# Altium schematic sheet Pg13_FPGA_Connectors.SchDoc: FPGA CONNECTORS
size A2; DocumentNumber: 13; SheetNumber: 13; SheetTotal: 16
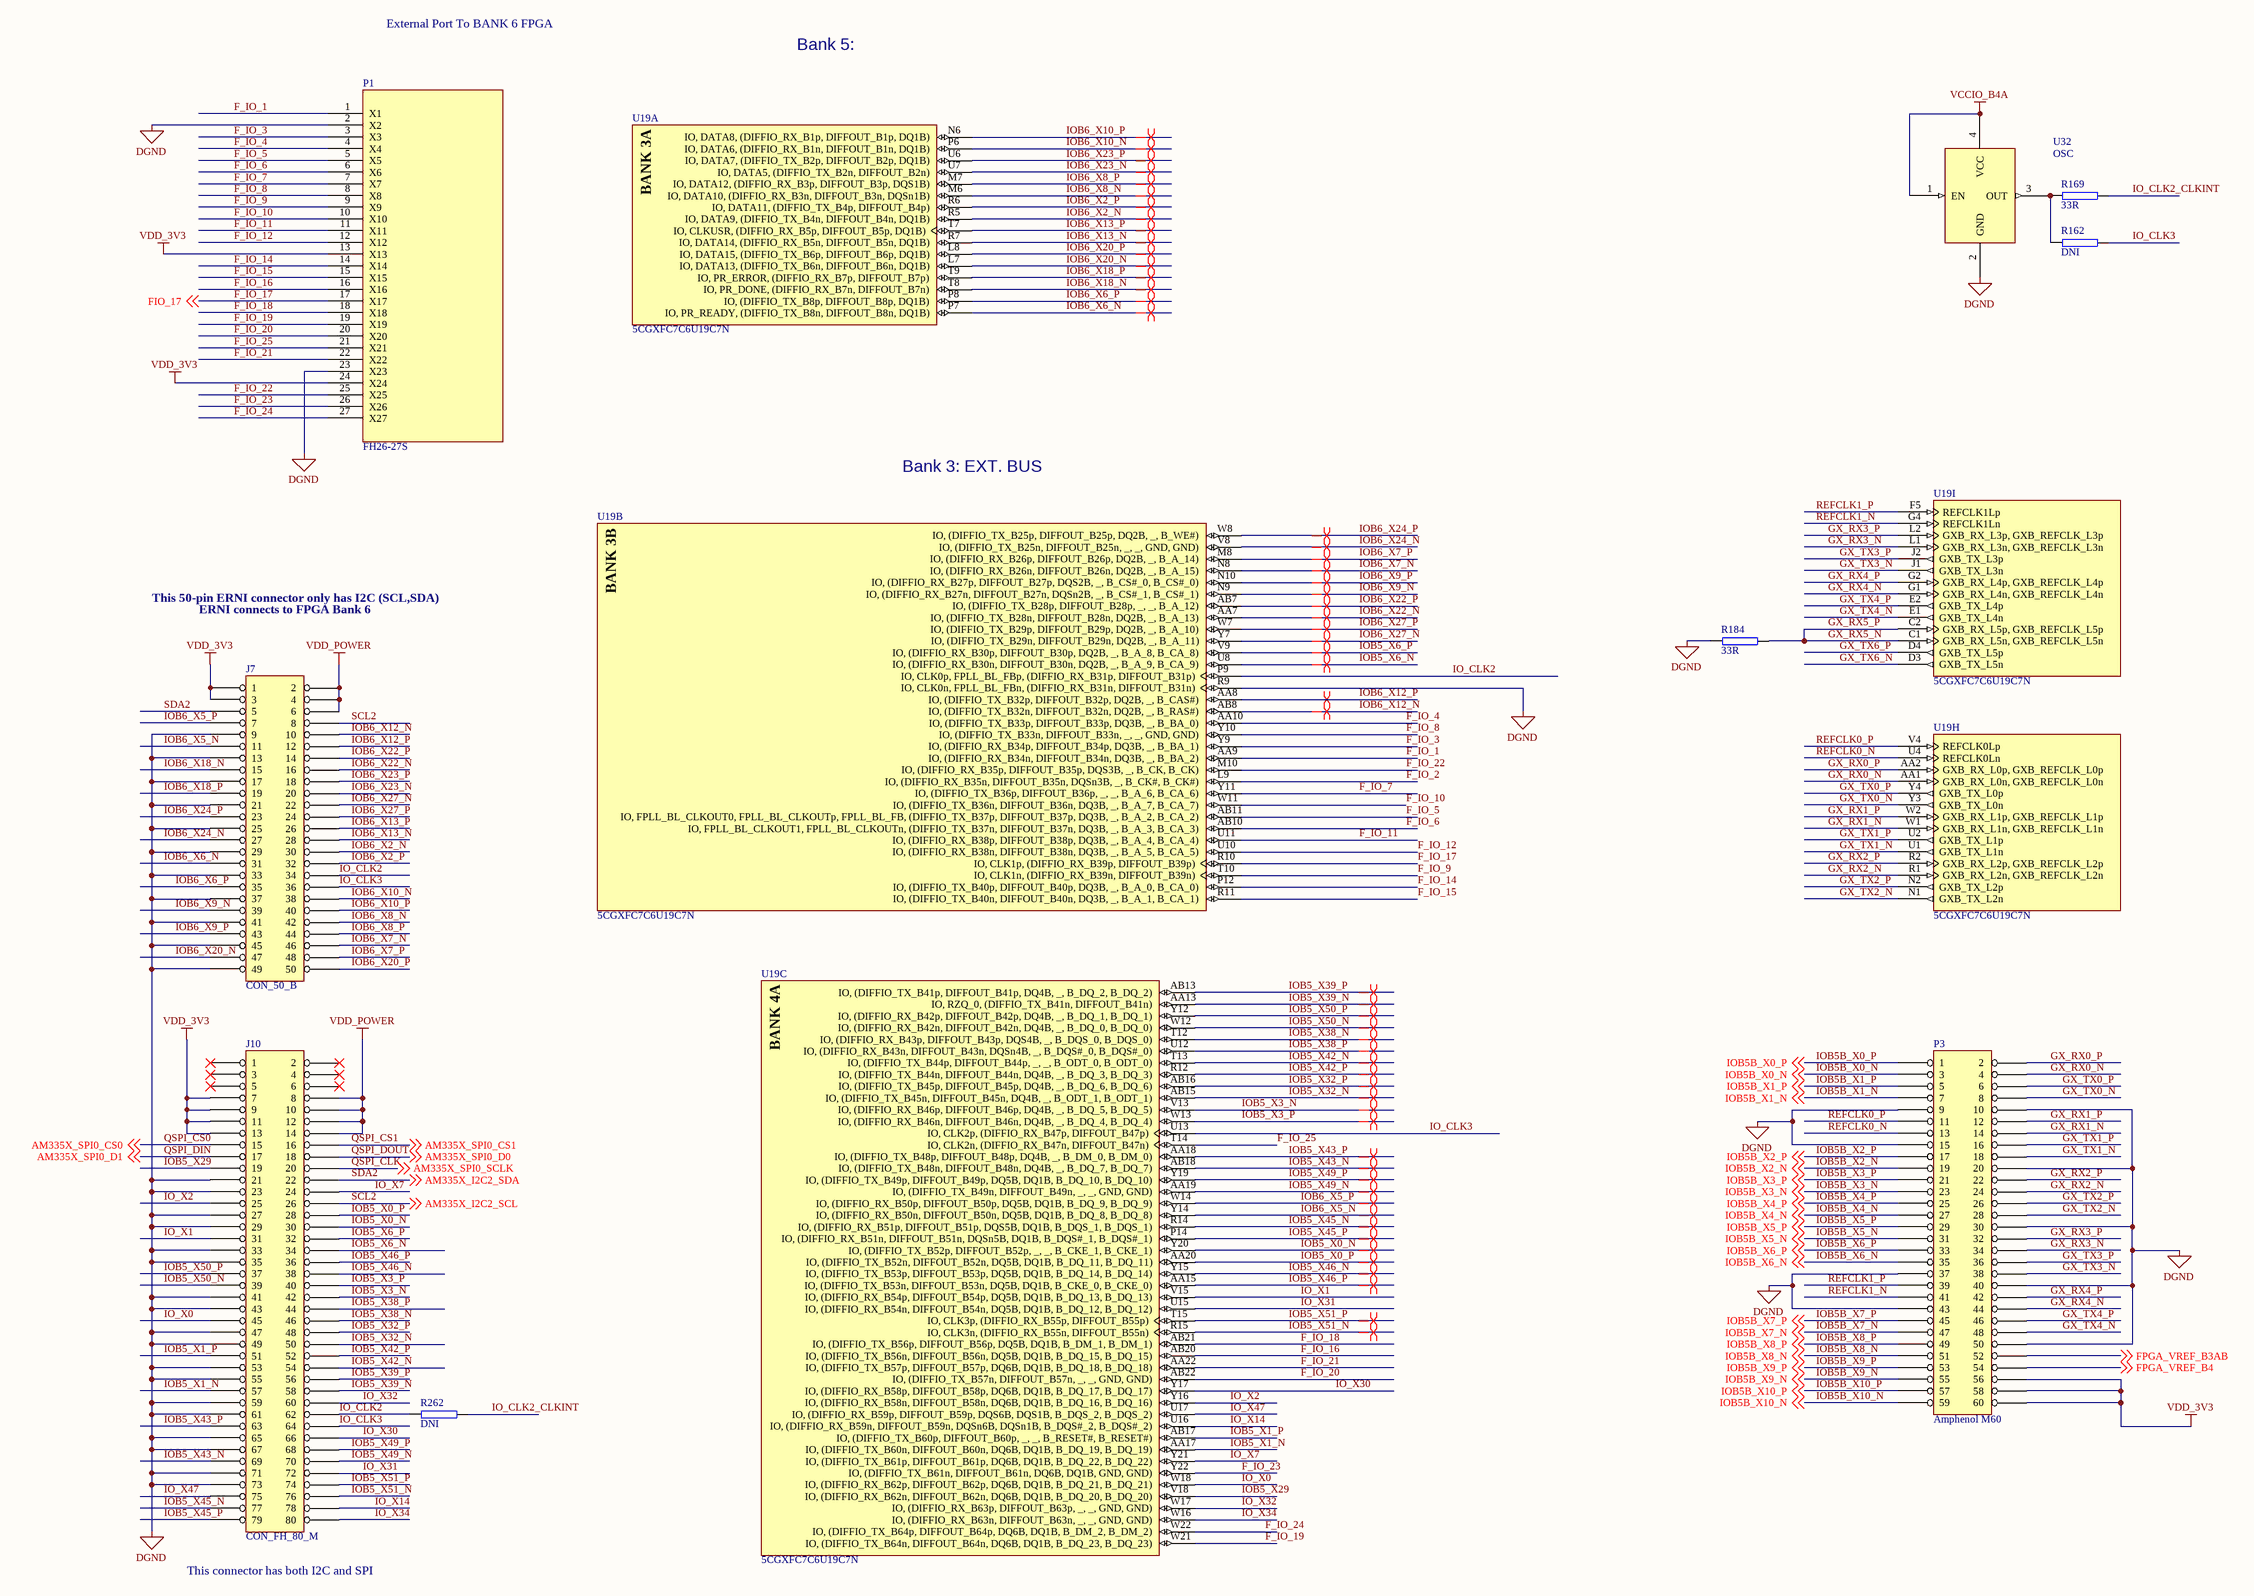
[diagram p0: Pg13_FPGA_Connectors.SchDoc]

## Parts
?  (no value)  (graphical)
J7  CON_50_B  [CON_50_B]
J10  CON_FH_80_M  [CON_FH_80_M]
P1  FH26-27S  [FH26-27S]
P3  Amphenol M60  [CON60_M]
R162  DNI  [sc0402]
R169  33R  [sc0402]
R184  33R  [sc0402]
R262  DNI  [sc0402]
U19  5CGXFC7C6U19C7N  [ALTR-UBGA484_A-190]  (parts A,B,C,H,I of 13)
U32  OSC  [Osc 3.2x2.5]

## Nets
DGND: J7.9 J7.13 J7.17 J7.21 J7.25 J7.29 J7.33 J7.37 J7.41 J7.45 J7.49 J10.21 J10.23 J10.27 J10.29 J10.33 J10.35 J10.41 J10.43 J10.47 J10.49 J10.53 J10.55 J10.59 J10.61 J10.65 J10.67 J10.71 J10.73 P1.2(X2) P1.23(X23) P3.9 P3.10 P3.15 P3.20 P3.30 P3.37 P3.40 P3.43 P3.50 R184.1 U19.R9(IO,_CLK0n,_FPLL_BL_FBn,_(DIFFIO_RX_B31n,_DIFFOUT_B31n)) U32.2(GND)
VCCIO_B4A: U32.1(EN) U32.4(VCC)
VDD_3V3: J7.1 J7.3 J10.7 J10.9 J10.11 J10.13 P1.13(X13) P1.24(X24) P3.56 P3.58 P3.60
VDD_POWER: J7.2 J7.4 J7.6 J10.8 J10.10 J10.12 J10.14
F_IO_1: P1.1(X1) U19.AA9(IO,_(DIFFIO_RX_B34n,_DIFFOUT_B34n,_DQ3B,__,_B_BA_2))
F_IO_2: U19.L9(IO,_(DIFFIO_RX_B35n,_DIFFOUT_B35n,_DQSn3B,__,_B_CK#,_B_CK#))
F_IO_3: P1.3(X3) U19.Y9(IO,_(DIFFIO_RX_B34p,_DIFFOUT_B34p,_DQ3B,__,_B_BA_1))
F_IO_4: P1.4(X4) U19.AA10(IO,_(DIFFIO_TX_B33p,_DIFFOUT_B33p,_DQ3B,__,_B_BA_0))
F_IO_5: P1.5(X5) U19.AB11(IO,_FPLL_BL_CLKOUT0,_FPLL_BL_CLKOUTp,_FPLL_BL_FB,_(DIFFIO_TX_B37p,_DIFFOUT_B37p,_DQ3B,__,_B_A_2,_B_CA_2))
F_IO_6: P1.6(X6) U19.AB10(IO,_FPLL_BL_CLKOUT1,_FPLL_BL_CLKOUTn,_(DIFFIO_TX_B37n,_DIFFOUT_B37n,_DQ3B,__,_B_A_3,_B_CA_3))
F_IO_7: P1.7(X7) U19.Y11(IO,_(DIFFIO_TX_B36p,_DIFFOUT_B36p,__,__,_B_A_6,_B_CA_6))
F_IO_8: P1.8(X8) U19.Y10(IO,_(DIFFIO_TX_B33n,_DIFFOUT_B33n,__,__,_GND,_GND))
F_IO_9: P1.9(X9) U19.T10(IO,_CLK1n,_(DIFFIO_RX_B39n,_DIFFOUT_B39n))
F_IO_10: P1.10(X10) U19.W11(IO,_(DIFFIO_TX_B36n,_DIFFOUT_B36n,_DQ3B,__,_B_A_7,_B_CA_7))
F_IO_11: P1.11(X11) U19.U11(IO,_(DIFFIO_RX_B38p,_DIFFOUT_B38p,_DQ3B,__,_B_A_4,_B_CA_4))
F_IO_12: P1.12(X12) U19.U10(IO,_(DIFFIO_RX_B38n,_DIFFOUT_B38n,_DQ3B,__,_B_A_5,_B_CA_5))
F_IO_14: P1.14(X14) U19.P12(IO,_(DIFFIO_TX_B40p,_DIFFOUT_B40p,_DQ3B,__,_B_A_0,_B_CA_0))
F_IO_15: P1.15(X15) U19.R11(IO,_(DIFFIO_TX_B40n,_DIFFOUT_B40n,_DQ3B,__,_B_A_1,_B_CA_1))
F_IO_16: P1.16(X16) U19.AB20(IO,_(DIFFIO_TX_B56n,_DIFFOUT_B56n,_DQ5B,_DQ1B,_B_DQ_15,_B_DQ_15))
F_IO_17: P1.17(X17) U19.R10(IO,_CLK1p,_(DIFFIO_RX_B39p,_DIFFOUT_B39p)) ; off-sheet FIO_17  [also labelled FIO_17]
F_IO_18: P1.18(X18) U19.AB21(IO,_(DIFFIO_TX_B56p,_DIFFOUT_B56p,_DQ5B,_DQ1B,_B_DM_1,_B_DM_1))
F_IO_19: P1.19(X19) U19.W21(IO,_(DIFFIO_TX_B64n,_DIFFOUT_B64n,_DQ6B,_DQ1B,_B_DQ_23,_B_DQ_23))
F_IO_20: P1.20(X20) U19.AB22(IO,_(DIFFIO_TX_B57n,_DIFFOUT_B57n,__,__,_GND,_GND))
F_IO_21: P1.22(X22) U19.AA22(IO,_(DIFFIO_TX_B57p,_DIFFOUT_B57p,_DQ6B,_DQ1B,_B_DQ_18,_B_DQ_18))
F_IO_22: P1.25(X25) U19.M10(IO,_(DIFFIO_RX_B35p,_DIFFOUT_B35p,_DQS3B,__,_B_CK,_B_CK))
F_IO_23: P1.26(X26) U19.Y22(IO,_(DIFFIO_TX_B61n,_DIFFOUT_B61n,_DQ6B,_DQ1B,_GND,_GND))
F_IO_24: P1.27(X27) U19.W22(IO,_(DIFFIO_TX_B64p,_DIFFOUT_B64p,_DQ6B,_DQ1B,_B_DM_2,_B_DM_2))
F_IO_25: P1.21(X21) U19.T14(IO,_CLK2n,_(DIFFIO_RX_B47n,_DIFFOUT_B47n))
FPGA_VREF_B3AB: P3.52 ; off-sheet FPGA_VREF_B3AB
FPGA_VREF_B4: P3.54 ; off-sheet FPGA_VREF_B4
GX_RX0_N: P3.4 U19.AA1(GXB_RX_L0n,_GXB_REFCLK_L0n)
GX_RX0_P: P3.2 U19.AA2(GXB_RX_L0p,_GXB_REFCLK_L0p)
GX_RX1_N: P3.14 U19.W1(GXB_RX_L1n,_GXB_REFCLK_L1n)
GX_RX1_P: P3.12 U19.W2(GXB_RX_L1p,_GXB_REFCLK_L1p)
GX_RX2_N: P3.24 U19.R1(GXB_RX_L2n,_GXB_REFCLK_L2n)
GX_RX2_P: P3.22 U19.R2(GXB_RX_L2p,_GXB_REFCLK_L2p)
GX_RX3_N: P3.34 U19.L1(GXB_RX_L3n,_GXB_REFCLK_L3n)
GX_RX3_P: P3.32 U19.L2(GXB_RX_L3p,_GXB_REFCLK_L3p)
GX_RX4_N: P3.44 U19.G1(GXB_RX_L4n,_GXB_REFCLK_L4n)
GX_RX4_P: P3.42 U19.G2(GXB_RX_L4p,_GXB_REFCLK_L4p)
GX_RX5_N: R184.2 U19.C1(GXB_RX_L5n,_GXB_REFCLK_L5n) U19.C2(GXB_RX_L5p,_GXB_REFCLK_L5p)  [also labelled GX_RX5_P]
GX_TX0_N: P3.8 U19.Y3(GXB_TX_L0n)
GX_TX0_P: P3.6 U19.Y4(GXB_TX_L0p)
GX_TX1_N: P3.18 U19.U1(GXB_TX_L1n)
GX_TX1_P: P3.16 U19.U2(GXB_TX_L1p)
GX_TX2_N: P3.28 U19.N1(GXB_TX_L2n)
GX_TX2_P: P3.26 U19.N2(GXB_TX_L2p)
GX_TX3_N: P3.38 U19.J1(GXB_TX_L3n)
GX_TX3_P: P3.36 U19.J2(GXB_TX_L3p)
GX_TX4_N: P3.48 U19.E1(GXB_TX_L4n)
GX_TX4_P: P3.46 U19.E2(GXB_TX_L4p)
GX_TX6_N: U19.D3(GXB_TX_L5n)
GX_TX6_P: U19.D4(GXB_TX_L5p)
IO_CLK2: J7.34 J10.62 R262.1 U19.P9(IO,_CLK0p,_FPLL_BL_FBp,_(DIFFIO_RX_B31p,_DIFFOUT_B31p))
IO_CLK2_CLKINT: R169.2 R262.2
IO_CLK3: J7.36 J10.64 R162.2 U19.U13(IO,_CLK2p,_(DIFFIO_RX_B47p,_DIFFOUT_B47p))
IO_X0: J10.45 U19.W18(IO,_(DIFFIO_RX_B62p,_DIFFOUT_B62p,_DQ6B,_DQ1B,_B_DQ_21,_B_DQ_21))
IO_X1: J10.31 U19.V15(IO,_(DIFFIO_RX_B54p,_DIFFOUT_B54p,_DQ5B,_DQ1B,_B_DQ_13,_B_DQ_13))
IO_X2: J10.25 U19.Y16(IO,_(DIFFIO_RX_B58n,_DIFFOUT_B58n,_DQ6B,_DQ1B,_B_DQ_16,_B_DQ_16))
IO_X7: J10.24 U19.Y21(IO,_(DIFFIO_TX_B61p,_DIFFOUT_B61p,_DQ6B,_DQ1B,_B_DQ_22,_B_DQ_22))
IO_X14: J10.78 U19.U16(IO,_(DIFFIO_RX_B59n,_DIFFOUT_B59n,_DQSn6B,_DQSn1B,_B_DQS#_2,_B_DQS#_2))
IO_X30: J10.66 U19.Y17(IO,_(DIFFIO_RX_B58p,_DIFFOUT_B58p,_DQ6B,_DQ1B,_B_DQ_17,_B_DQ_17))
IO_X31: J10.72 U19.U15(IO,_(DIFFIO_RX_B54n,_DIFFOUT_B54n,_DQ5B,_DQ1B,_B_DQ_12,_B_DQ_12))
IO_X32: J10.60 U19.W17(IO,_(DIFFIO_RX_B63p,_DIFFOUT_B63p,__,__,_GND,_GND))
IO_X34: J10.80 U19.W16(IO,_(DIFFIO_RX_B63n,_DIFFOUT_B63n,__,__,_GND,_GND))
IO_X47: J10.75 U19.U17(IO,_(DIFFIO_RX_B59p,_DIFFOUT_B59p,_DQS6B,_DQS1B,_B_DQS_2,_B_DQS_2))
IOB5_X0_N: J10.30 U19.Y20(IO,_(DIFFIO_TX_B52p,_DIFFOUT_B52p,__,__,_B_CKE_1,_B_CKE_1))
IOB5_X0_P: J10.28 U19.AA20(IO,_(DIFFIO_TX_B52n,_DIFFOUT_B52n,_DQ5B,_DQ1B,_B_DQ_11,_B_DQ_11))
IOB5_X1_N: J10.57 U19.AA17(IO,_(DIFFIO_TX_B60n,_DIFFOUT_B60n,_DQ6B,_DQ1B,_B_DQ_19,_B_DQ_19))
IOB5_X1_P: J10.51 U19.AB17(IO,_(DIFFIO_TX_B60p,_DIFFOUT_B60p,__,__,_B_RESET#,_B_RESET#))
IOB5_X3_N: J10.42 U19.V13(IO,_(DIFFIO_RX_B46p,_DIFFOUT_B46p,_DQ4B,__,_B_DQ_5,_B_DQ_5))
IOB5_X3_P: J10.40 U19.W13(IO,_(DIFFIO_RX_B46n,_DIFFOUT_B46n,_DQ4B,__,_B_DQ_4,_B_DQ_4))
IOB5_X6_N: J10.34 U19.U8(IO,_(DIFFIO_RX_B30n,_DIFFOUT_B30n,_DQ2B,__,_B_A_9,_B_CA_9))
IOB5_X6_P: J10.32 U19.V9(IO,_(DIFFIO_RX_B30p,_DIFFOUT_B30p,_DQ2B,__,_B_A_8,_B_CA_8))
IOB5_X29: J10.19 U19.V18(IO,_(DIFFIO_RX_B62n,_DIFFOUT_B62n,_DQ6B,_DQ1B,_B_DQ_20,_B_DQ_20))
IOB5_X32_N: J10.50 U19.AB15(IO,_(DIFFIO_TX_B45n,_DIFFOUT_B45n,_DQ4B,__,_B_ODT_1,_B_ODT_1))
IOB5_X32_P: J10.48 U19.AB16(IO,_(DIFFIO_TX_B45p,_DIFFOUT_B45p,_DQ4B,__,_B_DQ_6,_B_DQ_6))
IOB5_X38_N: J10.46 U19.T12(IO,_(DIFFIO_RX_B43p,_DIFFOUT_B43p,_DQS4B,__,_B_DQS_0,_B_DQS_0))
IOB5_X38_P: J10.44 U19.U12(IO,_(DIFFIO_RX_B43n,_DIFFOUT_B43n,_DQSn4B,__,_B_DQS#_0,_B_DQS#_0))
IOB5_X39_N: J10.58 U19.AA13(IO,_RZQ_0,_(DIFFIO_TX_B41n,_DIFFOUT_B41n))
IOB5_X39_P: J10.56 U19.AB13(IO,_(DIFFIO_TX_B41p,_DIFFOUT_B41p,_DQ4B,__,_B_DQ_2,_B_DQ_2))
IOB5_X42_N: J10.54 U19.T13(IO,_(DIFFIO_TX_B44p,_DIFFOUT_B44p,__,__,_B_ODT_0,_B_ODT_0))
IOB5_X42_P: J10.52 U19.R12(IO,_(DIFFIO_TX_B44n,_DIFFOUT_B44n,_DQ4B,__,_B_DQ_3,_B_DQ_3))
IOB5_X43_N: J10.69 U19.AB18(IO,_(DIFFIO_TX_B48n,_DIFFOUT_B48n,_DQ4B,__,_B_DQ_7,_B_DQ_7))
IOB5_X43_P: J10.63 U19.AA18(IO,_(DIFFIO_TX_B48p,_DIFFOUT_B48p,_DQ4B,__,_B_DM_0,_B_DM_0))
IOB5_X45_N: J10.77 U19.R14(IO,_(DIFFIO_RX_B51p,_DIFFOUT_B51p,_DQS5B,_DQ1B,_B_DQS_1,_B_DQS_1))
IOB5_X45_P: J10.79 U19.P14(IO,_(DIFFIO_RX_B51n,_DIFFOUT_B51n,_DQSn5B,_DQ1B,_B_DQS#_1,_B_DQS#_1))
IOB5_X46_N: J10.38 U19.Y15(IO,_(DIFFIO_TX_B53p,_DIFFOUT_B53p,_DQ5B,_DQ1B,_B_DQ_14,_B_DQ_14))
IOB5_X46_P: J10.36 U19.AA15(IO,_(DIFFIO_TX_B53n,_DIFFOUT_B53n,_DQ5B,_DQ1B,_B_CKE_0,_B_CKE_0))
IOB5_X49_N: J10.70 U19.AA19(IO,_(DIFFIO_TX_B49n,_DIFFOUT_B49n,__,__,_GND,_GND))
IOB5_X49_P: J10.68 U19.Y19(IO,_(DIFFIO_TX_B49p,_DIFFOUT_B49p,_DQ5B,_DQ1B,_B_DQ_10,_B_DQ_10))
IOB5_X50_N: J10.39 U19.W12(IO,_(DIFFIO_RX_B42n,_DIFFOUT_B42n,_DQ4B,__,_B_DQ_0,_B_DQ_0))
IOB5_X50_P: J10.37 U19.Y12(IO,_(DIFFIO_RX_B42p,_DIFFOUT_B42p,_DQ4B,__,_B_DQ_1,_B_DQ_1))
IOB5_X51_N: J10.76 U19.R15(IO,_CLK3n,_(DIFFIO_RX_B55n,_DIFFOUT_B55n))
IOB5_X51_P: J10.74 U19.T15(IO,_CLK3p,_(DIFFIO_RX_B55p,_DIFFOUT_B55p))
IOB5B_X0_N: P3.3 ; off-sheet IOB5B_X0_N
IOB5B_X0_P: P3.1 ; off-sheet IOB5B_X0_P
IOB5B_X1_N: P3.7 ; off-sheet IOB5B_X1_N
IOB5B_X1_P: P3.5 ; off-sheet IOB5B_X1_P
IOB5B_X2_N: P3.19 ; off-sheet IOB5B_X2_N
IOB5B_X2_P: P3.17 ; off-sheet IOB5B_X2_P
IOB5B_X3_N: P3.23 ; off-sheet IOB5B_X3_N
IOB5B_X3_P: P3.21 ; off-sheet IOB5B_X3_P
IOB5B_X4_N: P3.27 ; off-sheet IOB5B_X4_N
IOB5B_X4_P: P3.25 ; off-sheet IOB5B_X4_P
IOB5B_X5_N: P3.31 ; off-sheet IOB5B_X5_N
IOB5B_X5_P: P3.29 ; off-sheet IOB5B_X5_P
IOB5B_X6_N: P3.35 ; off-sheet IOB5B_X6_N
IOB5B_X6_P: P3.33 ; off-sheet IOB5B_X6_P
IOB5B_X7_N: P3.47 ; off-sheet IOB5B_X7_N
IOB5B_X7_P: P3.45 ; off-sheet IOB5B_X7_P
IOB5B_X8_N: P3.51 ; off-sheet IOB5B_X8_N
IOB5B_X8_P: P3.49 ; off-sheet IOB5B_X8_P
IOB5B_X9_N: P3.55 ; off-sheet IOB5B_X9_N
IOB5B_X9_P: P3.53 ; off-sheet IOB5B_X9_P
IOB5B_X10_N: P3.59 ; off-sheet IOB5B_X10_N
IOB5B_X10_P: P3.57 ; off-sheet IOB5B_X10_P
IOB6_X2_N: J7.30 U19.R5(IO,_DATA9,_(DIFFIO_TX_B4n,_DIFFOUT_B4n,_DQ1B))
IOB6_X2_P: J7.32 U19.R6(IO,_DATA11,_(DIFFIO_TX_B4p,_DIFFOUT_B4p))
IOB6_X5_N: J7.11 U19.Y14(IO,_(DIFFIO_RX_B50n,_DIFFOUT_B50n,_DQ5B,_DQ1B,_B_DQ_8,_B_DQ_8))
IOB6_X5_P: J7.7 U19.W14(IO,_(DIFFIO_RX_B50p,_DIFFOUT_B50p,_DQ5B,_DQ1B,_B_DQ_9,_B_DQ_9))
IOB6_X6_N: J7.31 U19.P7(IO,_PR_READY,_(DIFFIO_TX_B8n,_DIFFOUT_B8n,_DQ1B))
IOB6_X6_P: J7.35 U19.P8(IO,_(DIFFIO_TX_B8p,_DIFFOUT_B8p,_DQ1B))
IOB6_X7_N: J7.46 U19.N8(IO,_(DIFFIO_RX_B26n,_DIFFOUT_B26n,_DQ2B,__,_B_A_15))
IOB6_X7_P: J7.48 U19.M8(IO,_(DIFFIO_RX_B26p,_DIFFOUT_B26p,_DQ2B,__,_B_A_14))
IOB6_X8_N: J7.42 U19.M6(IO,_DATA10,_(DIFFIO_RX_B3n,_DIFFOUT_B3n,_DQSn1B))
IOB6_X8_P: J7.44 U19.M7(IO,_DATA12,_(DIFFIO_RX_B3p,_DIFFOUT_B3p,_DQS1B))
IOB6_X9_N: J7.39 U19.N9(IO,_(DIFFIO_RX_B27n,_DIFFOUT_B27n,_DQSn2B,__,_B_CS#_1,_B_CS#_1))
IOB6_X9_P: J7.43 U19.N10(IO,_(DIFFIO_RX_B27p,_DIFFOUT_B27p,_DQS2B,__,_B_CS#_0,_B_CS#_0))
IOB6_X10_N: J7.38 U19.P6(IO,_DATA6,_(DIFFIO_RX_B1n,_DIFFOUT_B1n,_DQ1B))
IOB6_X10_P: J7.40 U19.N6(IO,_DATA8,_(DIFFIO_RX_B1p,_DIFFOUT_B1p,_DQ1B))
IOB6_X12_N: J7.10 U19.AB8(IO,_(DIFFIO_TX_B32n,_DIFFOUT_B32n,_DQ2B,__,_B_RAS#))
IOB6_X12_P: J7.12 U19.AA8(IO,_(DIFFIO_TX_B32p,_DIFFOUT_B32p,_DQ2B,__,_B_CAS#))
IOB6_X13_N: J7.28 U19.R7(IO,_DATA14,_(DIFFIO_RX_B5n,_DIFFOUT_B5n,_DQ1B))
IOB6_X13_P: J7.26 U19.T7(IO,_CLKUSR,_(DIFFIO_RX_B5p,_DIFFOUT_B5p,_DQ1B))
IOB6_X18_N: J7.15 U19.T8(IO,_PR_DONE,_(DIFFIO_RX_B7n,_DIFFOUT_B7n))
IOB6_X18_P: J7.19 U19.T9(IO,_PR_ERROR,_(DIFFIO_RX_B7p,_DIFFOUT_B7p))
IOB6_X20_N: J7.47 U19.L7(IO,_DATA13,_(DIFFIO_TX_B6n,_DIFFOUT_B6n,_DQ1B))
IOB6_X20_P: J7.50 U19.L8(IO,_DATA15,_(DIFFIO_TX_B6p,_DIFFOUT_B6p,_DQ1B))
IOB6_X22_N: J7.16 U19.AA7(IO,_(DIFFIO_TX_B28n,_DIFFOUT_B28n,_DQ2B,__,_B_A_13))
IOB6_X22_P: J7.14 U19.AB7(IO,_(DIFFIO_TX_B28p,_DIFFOUT_B28p,__,__,_B_A_12))
IOB6_X23_N: J7.20 U19.U7(IO,_DATA5,_(DIFFIO_TX_B2n,_DIFFOUT_B2n))
IOB6_X23_P: J7.18 U19.U6(IO,_DATA7,_(DIFFIO_TX_B2p,_DIFFOUT_B2p,_DQ1B))
IOB6_X24_N: J7.27 U19.V8(IO,_(DIFFIO_TX_B25n,_DIFFOUT_B25n,__,__,_GND,_GND))
IOB6_X24_P: J7.23 U19.W8(IO,_(DIFFIO_TX_B25p,_DIFFOUT_B25p,_DQ2B,__,_B_WE#))
IOB6_X27_N: J7.22 U19.Y7(IO,_(DIFFIO_TX_B29n,_DIFFOUT_B29n,_DQ2B,__,_B_A_11))
IOB6_X27_P: J7.24 U19.W7(IO,_(DIFFIO_TX_B29p,_DIFFOUT_B29p,_DQ2B,__,_B_A_10))
QSPI_CLK: J10.20 ; off-sheet AM335X_SPI0_SCLK  [also labelled AM335X_SPI0_SCLK]
QSPI_CS0: J10.15 ; off-sheet AM335X_SPI0_CS0  [also labelled AM335X_SPI0_CS0]
QSPI_CS1: J10.16 ; off-sheet AM335X_SPI0_CS1  [also labelled AM335X_SPI0_CS1]
QSPI_DIN: J10.17 ; off-sheet AM335X_SPI0_D1  [also labelled AM335X_SPI0_D1]
QSPI_DOUT: J10.18 ; off-sheet AM335X_SPI0_D0  [also labelled AM335X_SPI0_D0]
REFCLK0_N: P3.13 U19.U4(REFCLK0Ln)
REFCLK0_P: P3.11 U19.V4(REFCLK0Lp)
REFCLK1_N: P3.41 U19.G4(REFCLK1Ln)
REFCLK1_P: P3.39 U19.F5(REFCLK1Lp)
SCL2: J7.8 J10.26 ; off-sheet AM335X_I2C2_SCL  [also labelled AM335X_I2C2_SCL]
SDA2: J7.5 J10.22 ; off-sheet AM335X_I2C2_SDA  [also labelled AM335X_I2C2_SDA]
NetR162_1: R162.1 R169.1 U32.3(OUT)

Not connected (* = marked no-connect by the designer): J10 1* 2* 3* 4* 5* 6*

## Layout directives
differential pair: IOB5_X0_N, IOB5_X0_P, IOB5_X3_N, IOB5_X3_P, IOB5_X6_N, IOB5_X6_P, IOB5_X32_N, IOB5_X32_P, IOB5_X38_N, IOB5_X38_P, IOB5_X39_N, IOB5_X39_P, IOB5_X42_N, IOB5_X42_P, IOB5_X43_N, IOB5_X43_P, IOB5_X45_N, IOB5_X45_P, IOB5_X46_N, IOB5_X46_P, IOB5_X49_N, IOB5_X49_P, IOB5_X50_N, IOB5_X50_P, IOB5_X51_N, IOB5_X51_P, IOB6_X2_N, IOB6_X2_P, IOB6_X5_N, IOB6_X5_P, IOB6_X6_N, IOB6_X6_P, IOB6_X7_N, IOB6_X7_P, IOB6_X8_N, IOB6_X8_P, IOB6_X9_N, IOB6_X9_P, IOB6_X10_N, IOB6_X10_P, IOB6_X12_N, IOB6_X12_P, IOB6_X13_N, IOB6_X13_P, IOB6_X18_N, IOB6_X18_P, IOB6_X20_N, IOB6_X20_P, IOB6_X22_N, IOB6_X22_P, IOB6_X23_N, IOB6_X23_P, IOB6_X24_N, IOB6_X24_P, IOB6_X27_N, IOB6_X27_P

## Notes on the sheet
- External Port To BANK 6 FPGA
- Bank 5:
- Bank 3: EXT. BUS
- This 50-pin ERNI connector only has I2C (SCL,SDA)
- ERNI connects to FPGA Bank 6
- (near J10) This connector has both I2C and SPI
- Embedded Vision Systems Group
- Title
- School of Electrical and Electronic Engineering
- Date:
- Size
- Document Number
- Sheet
- of
- Rev
- (in symbol 5CGXFC7C6U19C7N, part A) BANK 3A
- (in symbol 5CGXFC7C6U19C7N, part B) BANK 3B
- (in symbol 5CGXFC7C6U19C7N, part C) BANK 4A

## Library data of the parts
? = Title Block Address(1): UoM title block
J7 = CON_50_B: HEADER 25X2
J10 = CON_FH_80_M: AMPHENOL FH
P1 = FH26-27S: Flexible PCB connector
P3 = CON60_FH_M: Header vertical 60 M; Farnell: 1098336
R162 R169 R184 R262 = RES: Resistor
U19 = 5CGXFC7C6U19C7N: Cyclone V GX Family FPGA, 1.07 to 1.13 V Supply, 240 I/O Pins, 7 PLLs, 484-Pin UBGA, Speed Grade 7, Commercial Grade, RoHS Compliant; Manufacturer: Altera; GPIO: 240; Logic Elements (LE) (K): 149.5; Speed Grade: 7; DatasheetVersion: Rev. 3.4; PackageVersion: Rev. 1.0, 12/2011; PackageReference: UBGA484_A-190; PackageDescription: 484-Pin Ultra FineLine Ball-Grid Array (UBGA), Body 19 x 19 mm, Pitch 0.8 mm; Supplier 1: Digi-Key; Supplier Part Number 1: 5CGXFC7C6U19C7N-ND; Supplier 2: Mouser; Supplier Part Number 2: 989-5CGXFC7C6U19C7N; Device Group: 5CGXFC7; RoHS: RoHS Compliant; Subcategory: Cyclone V GX; Voltage Supply: 1.07 to 1.13 V; NexusDeviceID: 5CGXFC7C6U19C7N; Mounting Technology: Surface Mount; Code_JEDEC: MO-275-PPAA-2; PartNumber: 5CGXFC7C6U19C7N; ComponentLink1Description: Manufacturer URL; ComponentLink1URL: http://www.altera.com; ComponentLink2Description: Datasheet; ComponentLink2URL: http://www.altera.com/literature/hb/cyclone-v/cv_51002.pdf; ComponentLink3Description: Package Specification; ComponentLink3URL: http://www.altera.com/devicepackaging/04R00436-01.pdf; ComponentLink4Description: Device Handbook URL; ComponentLink4URL: http://www.altera.com/literature/hb/cyclone-v/cyclone5_handbook.pdf; ComponentLink5Description: Device Pin-Out URL; ComponentLink5URL: http://www.altera.com/literature/dp/cyclone-v/5CGXFC7.xls; ComponentLink6Description: Device Overview URL; ComponentLink6URL: http://www.altera.com/literature/hb/cyclone-v/cv_51001.pdf; ComponentLink7Description: Product URL; ComponentLink7URL: http://www.buyaltera.com/scripts/partsearch.dll?Detail&name=5CGXFC7C6U19C7N-ND
U32 = OSC: XTAL OSCILLATOR MODULE